# Altium schematic sheet PassProgrammer.SchDoc
size A4; SheetNumber: 1; SheetTotal: 1
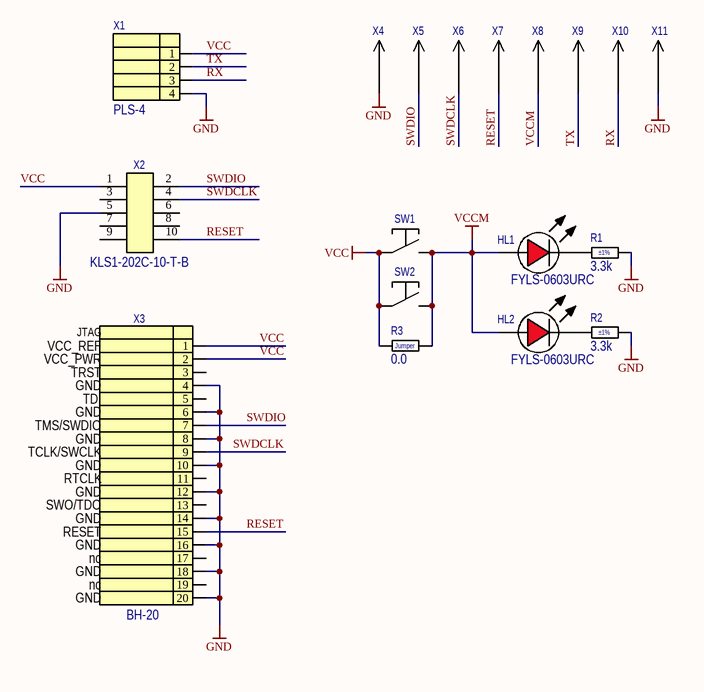
[diagram p0: PassProgrammer.SchDoc]

## Parts
HL1  FYLS-0603URC  [LED_0603_RED]
HL2  FYLS-0603URC  [LED_0603_RED]
R1  3.3k  Tolerance: ±1%  [R0603 (1608 Metric) N]
R2  3.3k  Tolerance: ±1%  [R0603 (1608 Metric) N]
R3  0.0  Tolerance: Jumper  [R0603 (1608 Metric) N]
SW1  EVQ-PBC04M  [TACT SWITCH 6MM SMD]  (value not drawn)
SW2  EVQ-PBC04M  [TACT SWITCH 6MM SMD]  (value not drawn)
X1  PLS-4  [PLS-4]
X2  KLS1-202C-10-T-B  [KLS1-202C-10-T-B]
X3  BH-20  [BH-20-H]
X4  POGOPIN-P75-B1  [POGO-PIN 1,02*15,85]  (value not drawn)
X5  POGOPIN-P75-B1  [POGO-PIN 1,02*15,85]  (value not drawn)
X6  POGOPIN-P75-B1  [POGO-PIN 1,02*15,85]  (value not drawn)
X7  POGOPIN-P75-B1  [POGO-PIN 1,02*15,85]  (value not drawn)
X8  POGOPIN-P75-B1  [POGO-PIN 1,02*15,85]  (value not drawn)
X9  POGOPIN-P75-B1  [POGO-PIN 1,02*15,85]  (value not drawn)
X10  POGOPIN-P75-B1  [POGO-PIN 1,02*15,85]  (value not drawn)
X11  POGOPIN-P75-B1  [POGO-PIN 1,02*15,85]  (value not drawn)

## Nets
GND: R1.2 R2.2 X1.4 X2.5 X3.4 X3.6 X3.8 X3.10 X3.12 X3.14 X3.16 X3.18 X3.20 X4.1 X11.1
VCC: R3.1 SW1.1 SW2.1 X1.1 X2.1 X3.1 X3.2
VCCM: HL1.A HL2.A R3.2 SW1.2 SW2.2 X8.1
RESET: X2.10 X3.15 X7.1
RX: X1.3 X10.1
SWDCLK: X2.4 X3.9 X6.1
SWDIO: X2.2 X3.7 X5.1
TX: X1.2 X9.1
NetHL1_C: HL1.C R1.1
NetHL2_C: HL2.C R2.1

Not connected (* = marked no-connect by the designer): X2 3 6 7 8 9; X3 3 5 11 13 17 19

## Notes on the sheet
- (in symbol Terminal_2x10_JTAG) JTAG; VCC_REF; VCC_PWR; TRST; GND; TDI; TMS/SWDIO; TCLK/SWCLK; RTCLK; SWO/TDO; RESET; nc

## Library data of the parts
HL1 HL2 = Led 0603 Red: Manufacturer: FORYARD; Points: 2; Part Number: FYLS-0603URC; ComponentLink1Description: Datasheet; Color: Led 0603 Red; ComponentLink1Description: Elitan; ComponentLink1URL: https://www.elitan.ru/pdf/1/4/8/3/0/14830587.pdf
R1 R2 = RC0603FR-073K3L: RES SMD 3.3K OHM 1% 1/10W 0603; Manufacturer: Yageo; Points: 2; ValueGOST: 3.3кОм; Unit Price (USD): 0.10000; Power (Watts): 0.1W, 1/10W; Temperature Coefficient: ±100ppm/°C; Part Number: RC0603FR-073K3L; ComponentLink1URL: http://www.yageo.com/documents/recent/PYu-RC_Grou; ComponentLink1Description: Datasheet; Supplier 1: Digikey; Supplier Part Number 1: 311-3.30KHRCT-ND; Value: 3.3k; Package / Case: 0603 (1608 Metric); Series: RC; Part Status: Active; Composition: Thick Film; Features: Moisture Resistant; Operating Temperature: -55°C ~ 155°C; Supplier Device Package: 0603; Size / Dimension: 0.063" L x 0.031" W (1.60mm x 0.80mm); Height - Seated (Max): 0.022" (0.55mm); Image: //media.digikey.com/Renders/Yageo%20Renders/0603-(1608-Metric).jpg; Part Type: Resistor
R3 = RC0603JR-070RL: RES SMD 0.0OHM JUMPER 1/10W 0603; Manufacturer: Yageo; Points: 2; Unit Price (USD): 0.10000; Power (Watts): 0.1W, 1/10W; Part Number: RC0603JR-070RL; ComponentLink1URL: http://www.yageo.com/documents/recent/PYu-RC_Grou; ComponentLink1Description: Datasheet; Supplier 1: Digikey; Supplier Part Number 1: 311-0.0GRCT-ND; Value: 0.0; ValueGOST: 0.0; Package / Case: 0603 (1608 Metric); Series: RC; Part Status: Active; Composition: Thick Film; Features: Moisture Resistant; Temperature Coefficient: -; Operating Temperature: -55°C ~ 155°C; Supplier Device Package: 0603; Size / Dimension: 0.063" L x 0.031" W (1.60mm x 0.80mm); Height - Seated (Max): 0.022" (0.55mm); Image: //media.digikey.com/Renders/Yageo%20Renders/0603-(1608-Metric).jpg; Part Type: Resistor
SW1 SW2 = EVQ-PBC04M: SWITCH TACTILE SPST-NO 0.02A 15V; Manufacturer: Panasonic Electronic Components; Switch Function: Off-Mom; Contact Rating @ Voltage: 0.02A @ 15VDC; Actuator Type: Standard; Actuator Height off PCB, Vertical: 4.30mm; Actuator Orientation: Top Actuated; Outline: 6.00mm x 6.00mm; Illumination: Non-Illuminated; Operating Force: 100gf; Part Number: EVQ-PBC04M; ﻿ComponentLink1URL: https://www3.panasonic.biz/ac/e_download/control/switch/light-touch/catalog/sw_lt_eng_5n.pdf; ComponentLink1Description: Datasheet; Supplier 1: Digikey; Supplier Part Number 1: P8013S-ND; Image: //media.digikey.com/photos/Panasonic%20Photos/EVQ-PBC04M,%20EVQ-PBD04M,%20EVQ-PBE04M,%20EVQ-PBG04M.jpg; Packaging: Bulk; Series: EVQPB; Part Status: Active; Circuit: SPST-NO; Mounting Type: Through Hole; Actuator Length, Right Angle: -; Termination Style: PC Pin; Illumination Type, Color: -; Illumination Voltage (Nominal): -; Ingress Protection: -; Features: Grounding Pin
X2 = KLS1-202C-10-T-B: 5*2 pin 	1.27x1.27mm Pitch Box Header Connector Height 4.9mm; Manufacturer: KLS; Number of Positions: 5; Pitch: 0.050" (1.27mm); Part Number: KLS1-202C-10-T-B; ComponentLink1URL: https://www.klsele.com/admin/product_upload/20200628111111L-KLS1-202CE.pdf; ComponentLink1Description: Datasheet; Number of Rows: 2; Mounting Type: 0.050" (1.27mm); Local Supplier: https://www.elitan.ru/price/item16066919
X3 = Terminal_2x10_JTAG: Part Number: BH-20
X4-X11 = PogoPin: Part Number: POGOPIN-P75-B1
X1 = PLS-4: Part Number: PLS-4; Series: PLS